# EAGLE schematic thundermaus (EAGLE 6.3)
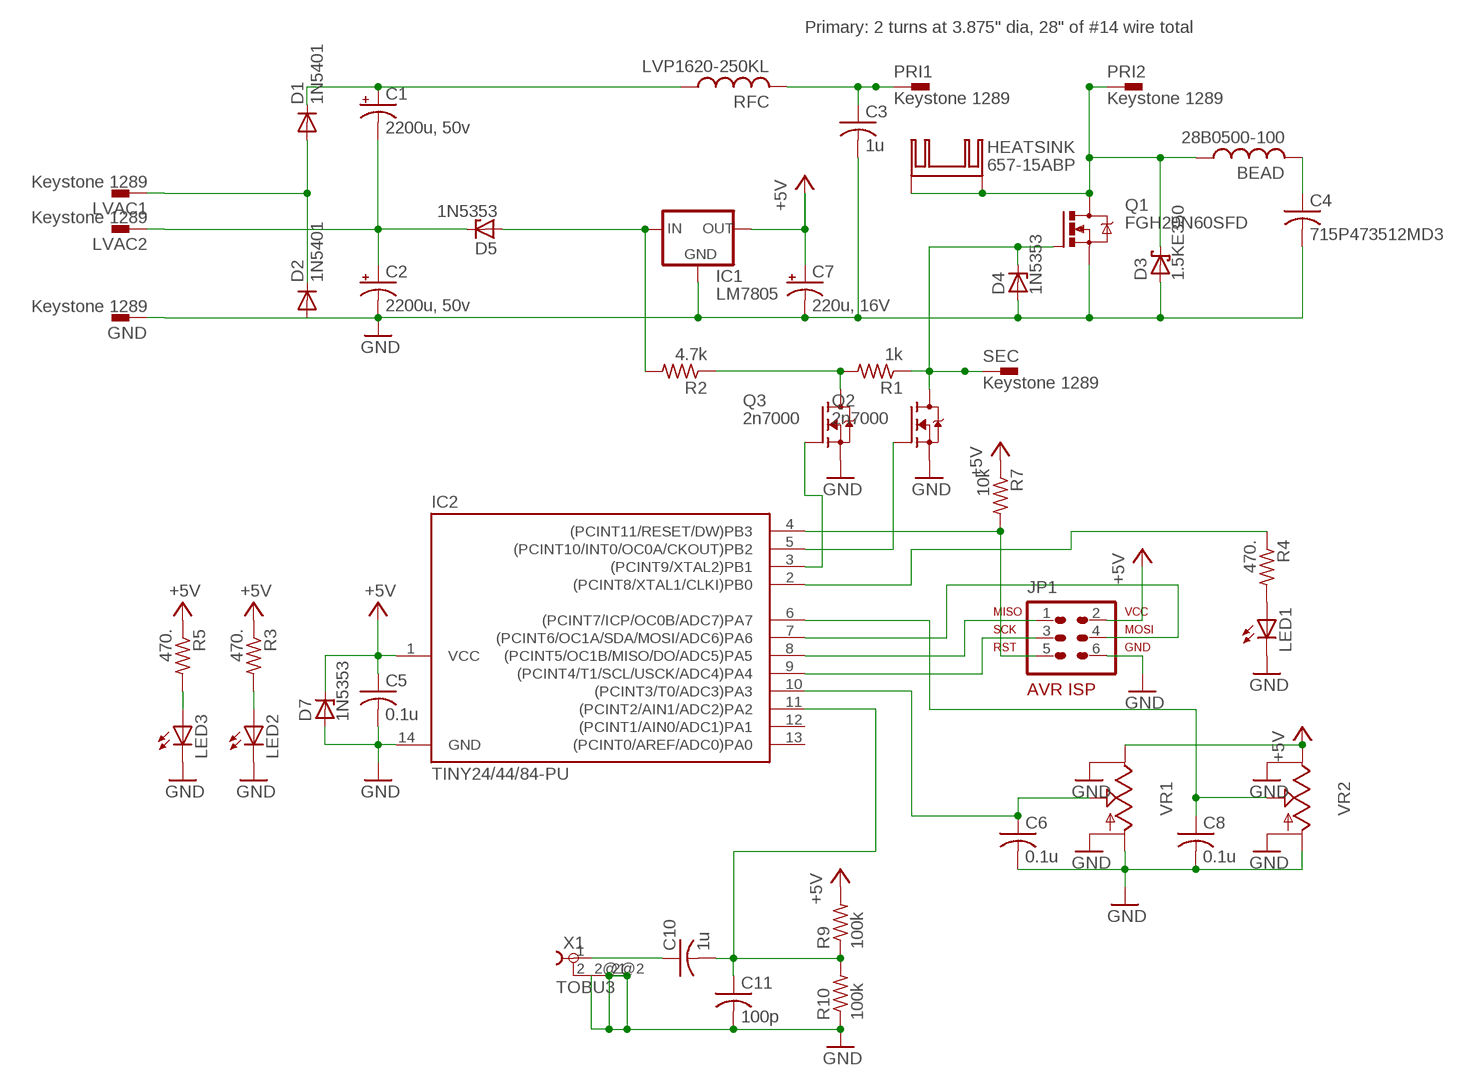
[diagram p0: schematic, sheet 1]

## Parts
BEAD  28B0500-100  L-US0207/10  [0207/10]
C1  2200u, 50v  CPOL-USE7.5-16  [E7,5-16]
C2  2200u, 50v  CPOL-USE7.5-16  [E7,5-16]
C3  1u  C-US225-062X268  [C225-062X268]
C4  715P473512MD3  C-US325-182X374  [C325-182X374]
C5  0.1u  C-US025-025X050  [C025-025X050]
C6  0.1u  C-US025-025X050  [C025-025X050]
C7  220u, 16V  CPOL-USE2.5-7  [E2,5-7]
C8  0.1u  C-US025-025X050  [C025-025X050]
C10  1u  C-US025-025X050  [C025-025X050]
C11  100p  C-US025-025X050  [C025-025X050]
D1  1N5401  1N5400  [DO201-15]
D2  1N5401  1N5400  [DO201-15]
D3  1.5KE350  15KEXXD  [DO201T15]
D4  1N5353  1N5333  [C1702-15]
D5  1N5353  1N5333  [C1702-15]
D7  1N5353  1N5333  [C1702-15]
GND  Keystone 1289  PIN2F061.060  [F061.060]
HEATSINK  657-15ABP  SK129-PAD  [SK129]
IC1  LM7805  78XXS  [78XXS]
IC2  TINY24/44/84-PU  [DIL14]
JP1  AVR-ISP-6VERT  [AVR-ISP-6]
LED1  LED5MM  [LED5MM]
LED2  LED5MM  [LED5MM]
LED3  LED5MM  [LED5MM]
LVAC1  Keystone 1289  PIN2F061.060  [F061.060]
LVAC2  Keystone 1289  PIN2F061.060  [F061.060]
PRI1  Keystone 1289  PIN2F061.060  [F061.060]
PRI2  Keystone 1289  PIN2F061.060  [F061.060]
Q1  FGH20N60SFD  IRFPC40  [TO247BV]
Q2  2n7000  2N7000  [TO237-SW]
Q3  2n7000  2N7000  [TO237-SW]
R1  1k  R-US_0207/10  [0207/10]
R2  4.7k  R-US_0207/10  [0207/10]
R3  470.  R-US_0207/10  [0207/10]
R4  470.  R-US_0207/10  [0207/10]
R5  470.  R-US_0207/10  [0207/10]
R7  10k  R-US_0207/10  [0207/10]
R9  100k  R-US_0207/10  [0207/10]
R10  100k  R-US_0207/10  [0207/10]
RFC  LVP1620-250KL  L-USTJ4-U1  [TJ4-U1]
SEC  Keystone 1289  PIN2F061.060  [F061.060]
VR1  PTV09  [PTV09]
VR2  PTV09  [PTV09]
X1  TOBU3  [TOBU3]

## Nets
5V: C5.1 C7.+ D7.C IC1.OUT IC2.1(VCC) JP1.2 R3.1 R5.1 R7.1 R9.2 VR1.P1(E) VR2.P1(E) ; supply symbol labelled +5V
16V: D5.A IC1.IN R2.2
70VDC: C1.+ D1.C RFC.1
AUDIO: C10.2 C11.1 IC2.11((PCINT2/AIN1/ADC2)PA2) R9.1 R10.2
AUDIO-IN: C10.1 X1.1
COLLECTOR: BEAD.1 D3.C HEATSINK.A2,5(K) HEATSINK.B2,5(K) PRI2.A1 PRI2.A2(1.1) Q1.D
GATE: D4.C Q1.G Q2.1(D) R1.1 SEC.A1 SEC.A2(1.1)
GND: C2.- C3.2 C4.2 C5.2 C6.2 C7.- C8.2 C11.2 D2.A D3.A D4.A D7.A GND.A1 GND.A2(1.1) IC1.GND IC2.14(GND) JP1.6 LED1.K(C) LED2.K(C) LED3.K(C) Q1.S Q2.3(S) Q3.3(S) R10.1 VR1.P3(A) VR1.P$4 VR1.P$5 VR2.P3(A) VR2.P$4 VR2.P$5 X1.2 X1.2@1 X1.2@2
HVDC: C3.1 PRI1.A1 PRI1.A2(1.1) RFC.2
LED: IC2.2((PCINT8/XTAL1/CLKI)PB0) R4.1
LED2-P: LED2.A R3.2
LED3-P: LED3.A R5.2
LEDP: LED1.A R4.2
LVAC1: D1.A D2.C LVAC1.A1 LVAC1.A2(1.1)
LVAC2: C1.- C2.+ D5.C LVAC2.A1 LVAC2.A2(1.1)
MISO: IC2.8((PCINT5/OC1B/MISO/DO/ADC5)PA5) JP1.1
MOSI: IC2.7((PCINT6/OC1A/SDA/MOSI/ADC6)PA6) JP1.4
PA3: C6.1 IC2.10((PCINT3/T0/ADC3)PA3) VR1.P2(S)
PA7: C8.1 IC2.6((PCINT7/ICP/OC0B/ADC7)PA7) VR2.P2(S)
PB1: IC2.3((PCINT9/XTAL2)PB1) Q3.2(G)
PB2: IC2.5((PCINT10/INT0/OC0A/CKOUT)PB2) Q2.2(G)
PULLUP_DISABLE: Q3.1(D) R1.2 R2.1
RESONANT: BEAD.2 C4.1
RST: IC2.4((PCINT11/RESET/DW)PB3) JP1.5 R7.2
SCK: IC2.9((PCINT4/T1/SCL/USCK/ADC4)PA4) JP1.3
Unconnected: IC2.12((PCINT1/AIN0/ADC1)PA1) IC2.13((PCINT0/AREF/ADC0)PA0)

## Notes on the sheet
- Primary: 2 turns at 3.875" dia, 28" of #14 wire total

## Library data of the parts
BEAD RFC = rcl:L-US: INDUCTOR, American symbol
C1 C2 C7 = rcl:CPOL-US: POLARIZED CAPACITOR, American symbol
C3-C6 C8 C10 C11 = rcl:C-US: CAPACITOR, American symbol
D1 D2 = diode:1N5400: DIODE standard rectifier, 3 A, 50 V (Motorola)
D3 = diode:15KEXXD: DIODE
D4 D5 D7 = diode:1N5333: Z DIODE 3.3 V, 5W, 5 percent (Motorola)
GND LVAC1 LVAC2 PRI1 PRI2 SEC = con-faston:PIN2: Flachstecker Typ Tyco/Electronics/AMP TAB, FASTON Printed Circuit Board Tabs Source: http://www.buerklin.com, http://catalog.tycoelectronics.com
HEATSINK = heatsink:SK129-PAD: HEATSINK manufacturer Fischer/distributor Buerklin
IC1 = v-reg:78XXS: VOLTAGE REGULATOR
IC2 = avr-7:TINY24/44/84
JP1 = avr-7:AVR-ISP-6: AVR ISP-6 Serial Programming Header
LED1-LED3 = led:LED: LED OSRAM: - CHIPLED LG R971, LG N971, LY N971, LG Q971, LY Q971, LO R971, LY R971 LH N974, LH R974 LS Q976, LO Q976, LY Q976 LO Q996 - Hyper CHIPLED LW Q18S LB Q993, LB Q99A, LB R99A - SideLED LS A670, LO A670, LY A670, LG A670, LP A670 LB A673, LV A673, LT A673, LW A673 LH A674 LY A675 LS A676, LA A676, LO A676, LY A676, LW A676 LS A679, LY A679, LG A679 - Hyper Micro SIDELED® LS Y876, LA Y876, LO Y876, LY Y876 LT Y87S - SmartLED LW L88C, LW L88S LB L89C, LB L89S, LG L890 LS L89K, LO L89K, LY L89K LS L896, LA L896, LO L896, LY L896 - TOPLED LS T670, LO T670, LY T670, LG T670, LP T670 LSG T670, LSP T670, LSY T670, LOP T670, LYG T670 LG T671, LOG T671, LSG T671 LB T673, LV T673, LT T673, LW T673 LH T674 LS T676, LA T676, LO T676, LY T676, LB T676, LH T676, LSB T676, LW T676 LB T67C, LV T67C, LT T67C, LS T67K, LO T67K, LY T67K, LW E67C LS E67B, LA E67B, LO E67B, LY E67B, LB E67C, LV E67C, LT E67C LW T67C LS T679, LY T679, LG T679 LS T770, LO T770, LY T770, LG T770, LP T770 LB T773, LV T773, LT T773, LW T773 LH T774 LS E675, LA E675, LY E675, LS T675 LS T776, LA T776, LO T776, LY T776, LB T776 LHGB T686 LT T68C, LB T68C - Hyper Mini TOPLED® LB M676 - Mini TOPLED Santana® LG M470 LS M47K, LO M47K, LY M47K Source: http://www.osram.convergy.de LUXEON: - LUMILED® LXK2-PW12-R00, LXK2-PW12-S00, LXK2-PW14-U00, LXK2-PW14-V00 LXK2-PM12-R00, LXK2-PM12-S00, LXK2-PM14-U00 LXK2-PE12-Q00, LXK2-PE12-R00, LXK2-PE12-S00, LXK2-PE14-T00, LXK2-PE14-U00 LXK2-PB12-K00, LXK2-PB12-L00, LXK2-PB12-M00, LXK2-PB14-N00, LXK2-PB14-P00, LXK2-PB14-Q00 LXK2-PR12-L00, LXK2-PR12-M00, LXK2-PR14-Q00, LXK2-PR14-R00 LXK2-PD12-Q00, LXK2-PD12-R00, LXK2-PD12-S00 LXK2-PH12-R00, LXK2-PH12-S00 LXK2-PL12-P00, LXK2-PL12-Q00, LXK2-PL12-R00 Source: www.luxeon.com KINGBRIGHT: KA-3528ASYC Source: www.kingbright.com
Q1 = transistor-power:IRFPC40: N-CHANNEL MOS FET
Q2 Q3 = transistor-fet:2N7000
R1-R5 R7 R9 R10 = rcl:R-US_: RESISTOR, American symbol
VR1 VR2 = pot2:PTV09
X1 = con-hirschmann:TOBU3: Female Cinch CONNECTOR ( RCA Jack )